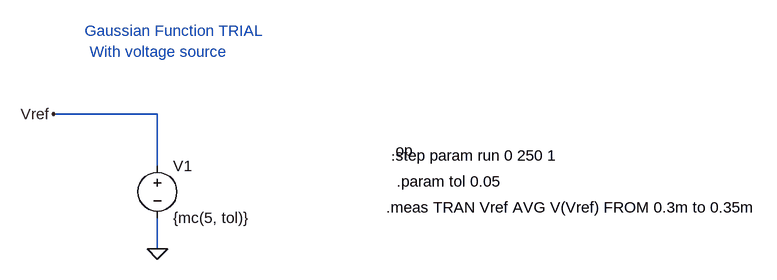
[diagram p0: schematic Gaussian_voltage_source.asc]
Gaussian_voltage_source.asc, the LTspice schematic file:
Version 4.1
SHEET 1 1288 680
WIRE 320 144 160 144
WIRE 320 224 320 144
WIRE 320 352 320 304
FLAG 320 352 0
FLAG 160 144 Vref
SYMBOL voltage 320 208 R0
SYMATTR InstName V1
SYMATTR Value {mc(5, tol)}
TEXT 208 16 Left 2 ;Gaussian Function TRIAL
TEXT 216 48 Left 2 ;With voltage source
TEXT 680 208 Left 2 !.step param run 0 250 1
TEXT 688 248 Left 2 !.param tol 0.05
TEXT 680 200 Left 2 !.op
TEXT 672 288 Left 2 !.meas TRAN Vref AVG V(Vref) FROM 0.3m to 0.35m

The netlist it stands for:
* Gaussian_voltage_source.asc
V1 Vref 0 {mc(5, tol)}
* Gaussian Function TRIAL
* With voltage source
.step param run 0 250 1
.param tol 0.05
.op
.meas TRAN Vref AVG V(Vref) FROM 0.3m to 0.35m
.backanno
.end